# Altium schematic sheet Array.SchDoc
size A
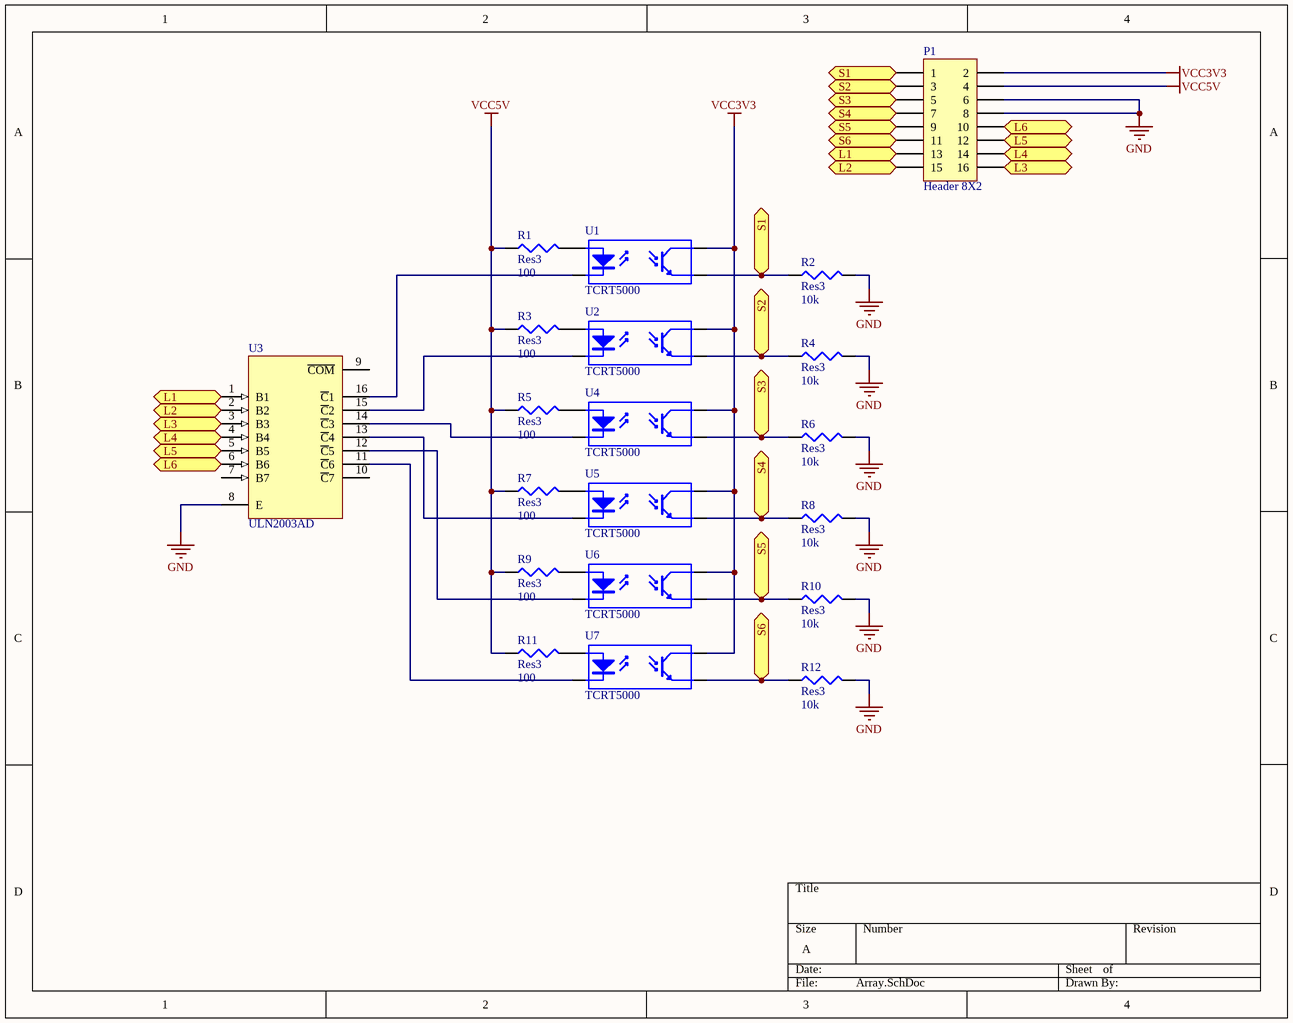
[diagram p0: Array.SchDoc]

## Parts
P1  Header 8X2  [HDR2X8]
R1  Res3  value 100  [AXIAL-0.3]
R2  Res3  value 10k  [AXIAL-0.3]
R3  Res3  value 100  [AXIAL-0.3]
R4  Res3  value 10k  [AXIAL-0.3]
R5  Res3  value 100  [AXIAL-0.3]
R6  Res3  value 10k  [AXIAL-0.3]
R7  Res3  value 100  [AXIAL-0.3]
R8  Res3  value 10k  [AXIAL-0.3]
R9  Res3  value 100  [AXIAL-0.3]
R10  Res3  value 10k  [AXIAL-0.3]
R11  Res3  value 100  [AXIAL-0.3]
R12  Res3  value 10k  [AXIAL-0.3]
U1  TCRT5000  [TCRT]
U2  TCRT5000  [TCRT]
U3  ULN2003AD  [N016]
U4  TCRT5000  [TCRT]
U5  TCRT5000  [TCRT]
U6  TCRT5000  [TCRT]
U7  TCRT5000  [TCRT]

## Ports
L1, L2, L3, L4, L5, L6, S1, S2, S3, S4, S5, S6

## Nets
GND: P1.6 P1.8 R2.2 R4.2 R6.2 R8.2 R10.2 R12.2 U3.8(E)
VCC3V3: P1.2 U1.1(A) U2.1(A) U4.1(A) U5.1(A) U6.1(A) U7.1(A)
VCC5V: P1.4 R1.1 R3.1 R5.1 R7.1 R9.1 R11.1
L1: P1.13 U3.1(B1) ; port L1
L2: P1.15 U3.2(B2) ; port L2
L3: P1.16 U3.3(B3) ; port L3
L4: P1.14 U3.4(B4) ; port L4
L5: P1.12 U3.5(B5) ; port L5
L6: P1.10 U3.6(B6) ; port L6
S1: P1.1 R2.1 U1.2(C) ; port S1
S2: P1.3 R4.1 U2.2(C) ; port S2
S3: P1.5 R6.1 U4.2(C) ; port S3
S4: P1.7 R8.1 U5.2(C) ; port S4
S5: P1.9 R10.1 U6.2(C) ; port S5
S6: P1.11 R12.1 U7.2(C) ; port S6
NetR1_2: R1.2 U1.3(C)
NetR3_2: R3.2 U2.3(C)
NetR5_2: R5.2 U4.3(C)
NetR7_2: R7.2 U5.3(C)
NetR9_2: R9.2 U6.3(C)
NetR11_2: R11.2 U7.3(C)
NetU1_4: U1.4(E) U3.16(~{C}1)
NetU2_4: U2.4(E) U3.15(~{C}2)
NetU3_11: U3.11(~{C}6) U7.4(E)
NetU3_12: U3.12(~{C}5) U6.4(E)
NetU3_13: U3.13(~{C}4) U5.4(E)
NetU3_14: U3.14(~{C}3) U4.4(E)

Not connected (* = marked no-connect by the designer): U3 7(B7) 9(~{COM}) 10(~{C}7)

## Library data of the parts
P1 = Header 8X2: Header, 8-Pin, Dual row; LatestRevisionDate: 17-Jul-2002; LatestRevisionNote: Re-released for DXP Platform.; Publisher: Altium Limited
R1-R12 = Res3: Resistor; Published: 8-Jun-2000; LatestRevisionDate: 29-May-2009; LatestRevisionNote: IPC-7351 Footprint Added.; PackageReference: J1-0603; Publisher: Altium Limited; PackageDescription: Chip Resistor
U3 = ULN2003AD: Darlington Transistor Array; Published: 15-May-2002; LatestRevisionDate: 13-Apr-2006; LatestRevisionNote: IPC-7351 Footprint Added.; DatasheetVersion: Sep-1986; PackageVersion: Jan-1998; PackageReference: D016; Publisher: Altium Limited; PackageDescription: 16-Pin Small Outline Integrated Circuit 1.27 mm Pitch; Code_IPC: SOIC127P600-16; ComponentLink1Description: Manufacturer Link; ComponentLink1URL: http://www.ti.com/; ComponentLink2Description: Datasheet; ComponentLink2URL: http://www-s.ti.com/sc/ds/uln2002a.pdf
U1 U2 U4-U7 = TCRT5000: Published: 24-Mar-1999; LatestRevisionDate: 04-Mar-2005; LatestRevisionNote: Sch pins 3 & 4 Swapped.; DatasheetVersion: Nov-2003; PackageReference: DIP-4; Publisher: Altium Limited